# Altium schematic sheet BDC_Motor_V01_220805.SchDoc
size A3
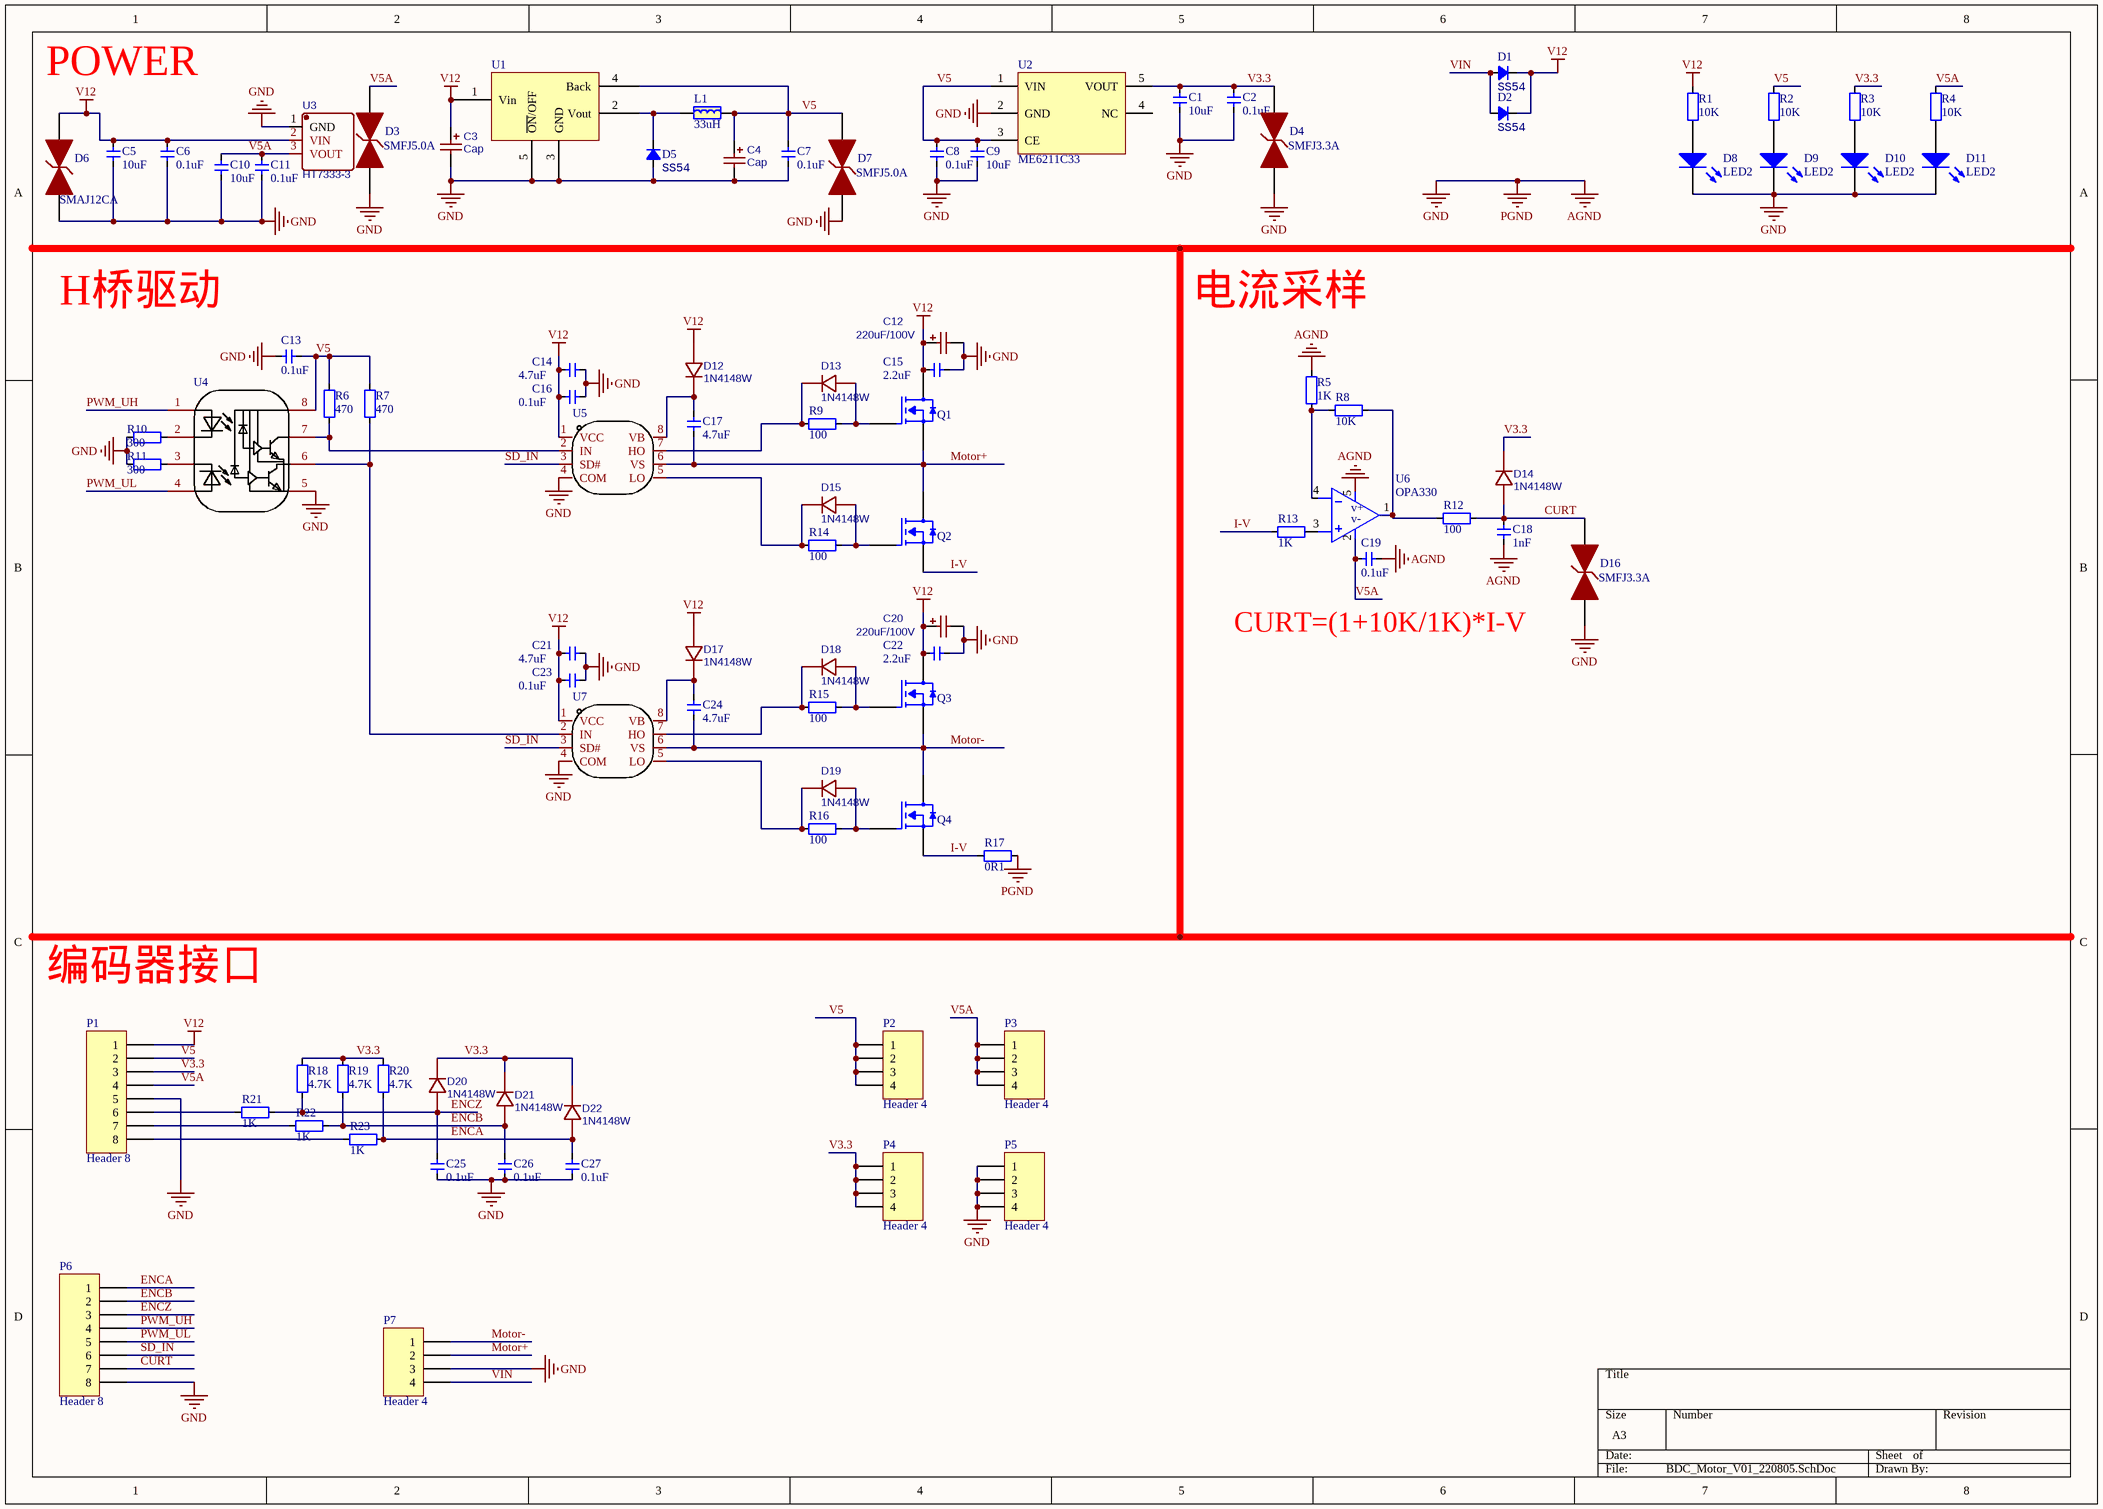
[diagram p0: BDC_Motor_V01_220805.SchDoc]

## Parts
C1  10uF  [C0603]
C2  0.1uF  [C0603]
C3  Cap  [CAP-SMD_L7.3-W4.3]
C4  Cap  [CAP-SMD_L3.5-W2.8]
C5  10uF  [C0603]
C6  0.1uF  [C0603]
C7  0.1uF  [C0603]
C8  0.1uF  [C0603]
C9  10uF  [C0603]
C10  10uF  [C0603]
C11  0.1uF  [C0603]
C12  220uF/100V  [CAP-TH_BD13.0-P5.00-D1.2-FD]
C13  0.1uF  [C0603]
C14  4.7uF  [C0603]
C15  2.2uF  [C0603]
C16  0.1uF  [C0603]
C17  4.7uF  [C0603]
C18  1nF  [C0603]
C19  0.1uF  [C0603]
C20  220uF/100V  [CAP-TH_BD13.0-P5.00-D1.2-FD]
C21  4.7uF  [C0603]
C22  2.2uF  [C0603]
C23  0.1uF  [C0603]
C24  4.7uF  [C0603]
C25  0.1uF  [C0603]
C26  0.1uF  [C0603]
C27  0.1uF  [C0603]
D1  SS54  [DO-214AC]
D2  SS54  [DO-214AC]
D3  SMFJ5.0A  [SMBJ-CA_MFG]
D4  SMFJ3.3A  [SMBJ-CA_MFG]
D5  SS54  [DO-214AC]
D6  SMAJ12CA  [SMBJ-CA_MFG]
D7  SMFJ5.0A  [SMBJ-CA_MFG]
D8  LED2  [SOD-123FL_L2.6-W1.6-LS3.4-RD]
D9  LED2  [SOD-123FL_L2.6-W1.6-LS3.4-RD]
D10  LED2  [SOD-123FL_L2.6-W1.6-LS3.4-RD]
D11  LED2  [SOD-123FL_L2.6-W1.6-LS3.4-RD]
D12  1N4148W  [SOD-123FL_L2.6-W1.6-LS3.4-RD]
D13  1N4148W  [SOD-123FL_L2.6-W1.6-LS3.4-RD]
D14  1N4148W  [SOD-123FL_L2.6-W1.6-LS3.4-RD]
D15  1N4148W  [SOD-123FL_L2.6-W1.6-LS3.4-RD]
D16  SMFJ3.3A  [SMBJ-CA_MFG]
D17  1N4148W  [SOD-123FL_L2.6-W1.6-LS3.4-RD]
D18  1N4148W  [SOD-123FL_L2.6-W1.6-LS3.4-RD]
D19  1N4148W  [SOD-123FL_L2.6-W1.6-LS3.4-RD]
D20  1N4148W  [SOD-123FL_L2.6-W1.6-LS3.4-RD]
D21  1N4148W  [SOD-123FL_L2.6-W1.6-LS3.4-RD]
D22  1N4148W  [SOD-123FL_L2.6-W1.6-LS3.4-RD]
L1  33uH  [IND-SMD_L7.3-W7.3_YPRH0704]
P1  Header 8  [CONN-TH_8P-P2.50_ZH-8A]
P2  Header 4  [HDR1X4]
P3  Header 4  [HDR1X4]
P4  Header 4  [HDR1X4]
P5  Header 4  [HDR1X4]
P6  Header 8  [HDR1X8]
P7  Header 4  [CONN-TH_4P-P3.81_KF2EDGV-3.81-4P]
Q1  AO3400A  [SOT23-3]  (value not drawn)
Q2  AO3400A  [SOT23-3]  (value not drawn)
Q3  AO3400A  [SOT23-3]  (value not drawn)
Q4  AO3400A  [SOT23-3]  (value not drawn)
R1  10K  [R0603]
R2  10K  [R0603]
R3  10K  [R0603]
R4  10K  [R0603]
R5  1K  [R0603]
R6  470  [R0603]
R7  470  [R0603]
R8  10K  [R0603]
R9  100  [R0603]
R10  300  [R0603]
R11  300  [R0603]
R12  100  [R0603]
R13  1K  [R0603]
R14  100  [R0603]
R15  100  [R0603]
R16  100  [R0603]
R17  0R1  [R1206]
R18  4.7K  [R0603]
R19  4.7K  [R0603]
R20  4.7K  [R0603]
R21  1K  [R0603]
R22  1K  [R0603]
R23  1K  [R0603]
U1  RS2596U  [TO-263-5_L10.2-W8.9-P1.70-LS15.2-BR]  (value not drawn)
U2  ME6211C33  [SOT23-5]
U3  HT7333-3  [SOT-89-3_L4.5-W2.5-P1.50-LS4.1-BR]
U4  EL0631(TA)  [SOP-8-SMD-8_L4.9-W4.0-P1.27-LS5.9-BL]  (value not drawn)
U5  IR2104STRPBF  [SOIC-8_L4.9-W3.9-P1.27-LS6.0-BL]  (value not drawn)
U6  OPA330  [SOT23-5]
U7  IR2104STRPBF  [SOIC-8_L4.9-W3.9-P1.27-LS6.0-BL]  (value not drawn)

## Nets
AGND: C1.1 C2.1 C3.2 C4.2 C5.1 C6.1 C7.1 C8.1 C9.1 C10.1 C11.1 C12.2 C13.1 C14.1 C15.2 C16.1 C18.2 C19.1 C20.2 C21.1 C22.2 C23.1 C25.2 C26.2 C27.2 D3.1 D4.1 D5.2(A) D6.1 D7.1 D8.1(K) D9.1(K) D10.1(K) D11.1(K) D16.1 P1.5 P5.1 P5.2 P5.3 P5.4 P6.8 P7.3 R5.1 R10.1 R11.1 R17.2 U1.3(GND) U1.5(~{ON}/OFF) U2.2(GND) U3.1(GND) U4.5 U5.4(COM) U6.5(v+) U7.4(COM)  [also labelled GND, PGND]
V12: C3.1 C5.2 C6.2 C12.1 C14.2 C15.1 C16.2 C20.1 C21.2 C22.1 C23.2 D1.1(K) D2.1(K) D6.2 D12.2 D17.2 P1.1 Q1.3(D) Q3.3(D) R1.1 U1.1(Vin) U3.2(VIN) U5.1(VCC) U7.1(VCC)
CURT: C18.1 D14.2 D16.2 P6.7 R12.1
ENCA: C27.1 D22.2 P6.1 R20.2 R23.1
ENCB: C26.1 D21.2 P6.2 R19.2 R22.1
ENCZ: C25.1 D20.2 P6.3 R18.2 R21.1
I-V: Q2.2(S) Q4.2(S) R13.2 R17.1
Motor+: C17.2 P7.2 Q1.2(S) Q2.3(D) U5.6(VS)
Motor-: C24.2 P7.1 Q3.2(S) Q4.3(D) U7.6(VS)
PWM_UH: P6.4 U4.1
PWM_UL: P6.5 U4.4
SD_IN: P6.6 U5.3(SD#) U7.3(SD#)
V3.3: C1.2 C2.2 D4.2 D14.1 D20.1 D21.1 D22.1 P1.3 P4.1 P4.2 P4.3 P4.4 R3.1 R18.1 R19.1 R20.1 U2.5(VOUT)
V5: C4.1 C7.2 C8.2 C9.2 C13.2 D7.2 L1.2 P1.2 P2.1 P2.2 P2.3 P2.4 R2.1 R6.2 R7.2 U1.4(Back) U2.1(VIN) U2.3(CE) U4.8
V5A: C10.2 C11.2 C19.2 D3.2 P1.4 P3.1 P3.2 P3.3 P3.4 R4.1 U3.3(VOUT) U6.2(v-)
VIN: D1.2(A) D2.2(A) P7.4
NetC17_1: C17.1 D12.1 U5.8(VB)
NetC24_1: C24.1 D17.1 U7.8(VB)
NetD5_1: D5.1(K) L1.1 U1.2(Vout)
NetD8_2: D8.2(A) R1.2
NetD9_2: D9.2(A) R2.2
NetD10_2: D10.2(A) R3.2
NetD11_2: D11.2(A) R4.2
NetD13_1: D13.1 R9.2 U5.7(HO)
NetD13_2: D13.2 Q1.1(G) R9.1
NetD15_1: D15.1 R14.2 U5.5(LO)
NetD15_2: D15.2 Q2.1(G) R14.1
NetD18_1: D18.1 R15.2 U7.7(HO)
NetD18_2: D18.2 Q3.1(G) R15.1
NetD19_1: D19.1 R16.2 U7.5(LO)
NetD19_2: D19.2 Q4.1(G) R16.1
NetP1_6: P1.6 R21.2
NetP1_7: P1.7 R22.2
NetP1_8: P1.8 R23.2
NetR5_2: R5.2 R8.2 U6.4(-)
NetR6_1: R6.1 U4.7 U5.2(IN)
NetR7_1: R7.1 U4.6 U7.2(IN)
NetR8_1: R8.1 R12.2 U6.1(out)
NetR10_2: R10.2 U4.2
NetR11_2: R11.2 U4.3
NetR13_1: R13.1 U6.3(+)

Not connected (* = marked no-connect by the designer): U2 4(NC)

## Notes on the sheet
- POWER
- H桥驱动
- 电流采样
- CURT=(1+10K/1K)*I-V
- 编码器接口

## Library data of the parts
C1 C2 C5-C11 C13-C19 C21-C27 = 电容: Capacitor; Value: 0.1u
C3 C4 C12 C20 = 极性电容: BOM_Manufacturer: CEC; BOM_Manufacturer Part: CA45-A-16V-10uF-K; nameAlias: Capacitance; Contributor: LCSC; BOM_Supplier: LCSC; BOM_Supplier Part: C128254; BOM_JLCPCB Part Class: Extended Part; spicePre: C; spiceSymbolName: CA45-A-16V-10UF-K
D1 D2 D5 = Diode_SMA: Diode; Type: SMA; Value: SS54
D3 D4 D6 D7 D16 = SMBJ28CA
D8-D11 = LED2: Typical RED, GREEN, YELLOW, AMBER GaAs LED; Published: 8-Jun-2000; LatestRevisionDate: 17-Jul-2002; LatestRevisionNote: Re-released for DXP Platform.; PackageVersion: Feb-2002; PackageReference: 3.2X1.6X1.1; Publisher: Altium Limited
D12-D15 D17-D22 = 1N4148W: BOM_Manufacturer: Tak Cheong; Contributor: LCEDA_Lib; BOM_Supplier: LCSC; BOM_Manufacturer Part: 1N4148W; BOM_Supplier Part: C129216; spicePre: D; spiceSymbolName: 1N4148W
L1 = 电感
P1 P6 = Header 8: Header, 8-Pin; LatestRevisionDate: 17-Jul-2002; LatestRevisionNote: Re-released for DXP Platform.; Publisher: Altium Limited
P2-P5 P7 = Header 4: Header, 4-Pin; LatestRevisionDate: 17-Jul-2002; LatestRevisionNote: Re-released for DXP Platform.; Publisher: Altium Limited
Q1-Q4 = AO3400A: N-MOS
R1-R23 = 电阻: Resistor; Value: 22R
U1 = RS2596U: Symbol: RS2596-50UG; Add into BOM: yes; Device: RS2596U; Supplier Part: C130309; Manufacturer Part: RS2596U; Supplier Footprint: TO-263-5; JLCPCB Part Class: Extended Part; Datasheet: https://atta.szlcsc.com/upload/public/pdf/source/20170925/C130309_1506321438414990205.pdf; Supplier: LCSC; Convert to PCB: yes; Synchronous Rectification: -; Number of Outputs: -; Topology: -; Input Voltage: -; Output Current (Max): -; Switching Frequency: -
U2 = ME6211C33: LDO
U3 = HT7333-3: BOM_Manufacturer: HOLTEK; BOM_Supplier: LCSC; BOM_Manufacturer Part: HT7333-3; BOM_Supplier Part: C84207; BOM_JLCPCB Part Class: Extended Part; spicePre: U; spiceSymbolName: HT7333-3
U4 = EL0631(TA): Add into BOM: yes; Symbol: EL0631(TA); Device: EL0631(TA); LCSC Part Name: EL0631(TA); Supplier Part: C465944; Manufacturer Part: EL0631(TA); Supplier Footprint: SOP-8; JLCPCB Part Class: Extended Part; Datasheet: https://atta.szlcsc.com/upload/public/pdf/source/20191217/C465944_BD7E258C801831E1F81037B40BF74E26.pdf; Supplier: LCSC; Convert to PCB: yes
U5 U7 = IR2104STRPBF: Add into BOM: yes; Symbol: IR2104STRPBF; Device: IR2104STRPBF; LCSC Part Name: IR2104STRPBF; Supplier Part: C2960; Manufacturer Part: IR2104STRPBF; Supplier Footprint: SOIC-8_150mil; JLCPCB Part Class: Extended Part; Datasheet: https://atta.szlcsc.com/upload/public/pdf/source/20140906/1457707236579.pdf; Supplier: LCSC; Convert to PCB: yes